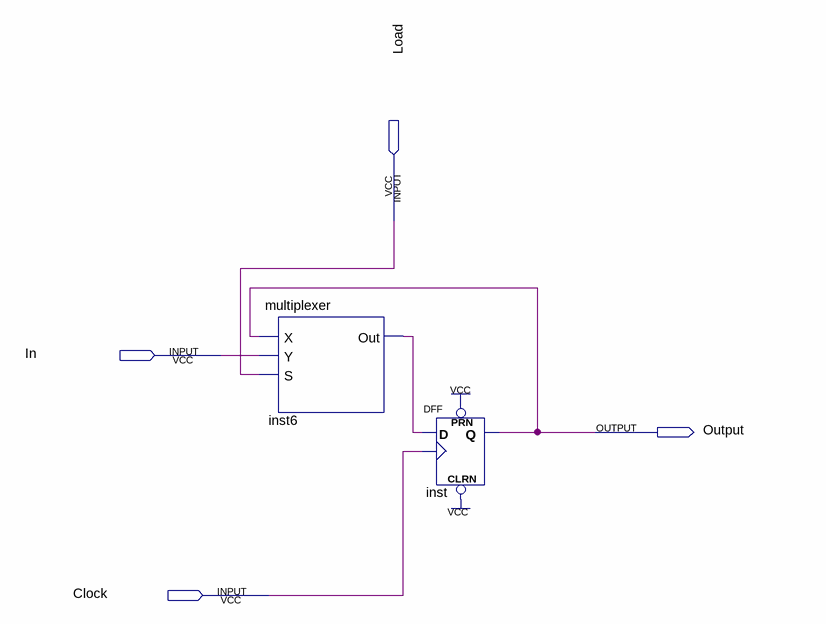
[diagram p0: schematic sheet]
// Quartus schematic Register.bdf as structural Verilog: 2 symbols, 4 pins
module Register (
  input  Load,
  input  In,
  input  Clock,
  output Output
);

  wire inst6_out;

  multiplexer inst6 (.X(Output), .Y(In), .S(Load), .Out(inst6_out));
  DFF inst (.CLRN(1'b1), .CLK(Clock), .D(inst6_out), .PRN(1'b1), .Q(Output));
endmodule
